# Altium schematic sheet PIC.SchDoc
size A
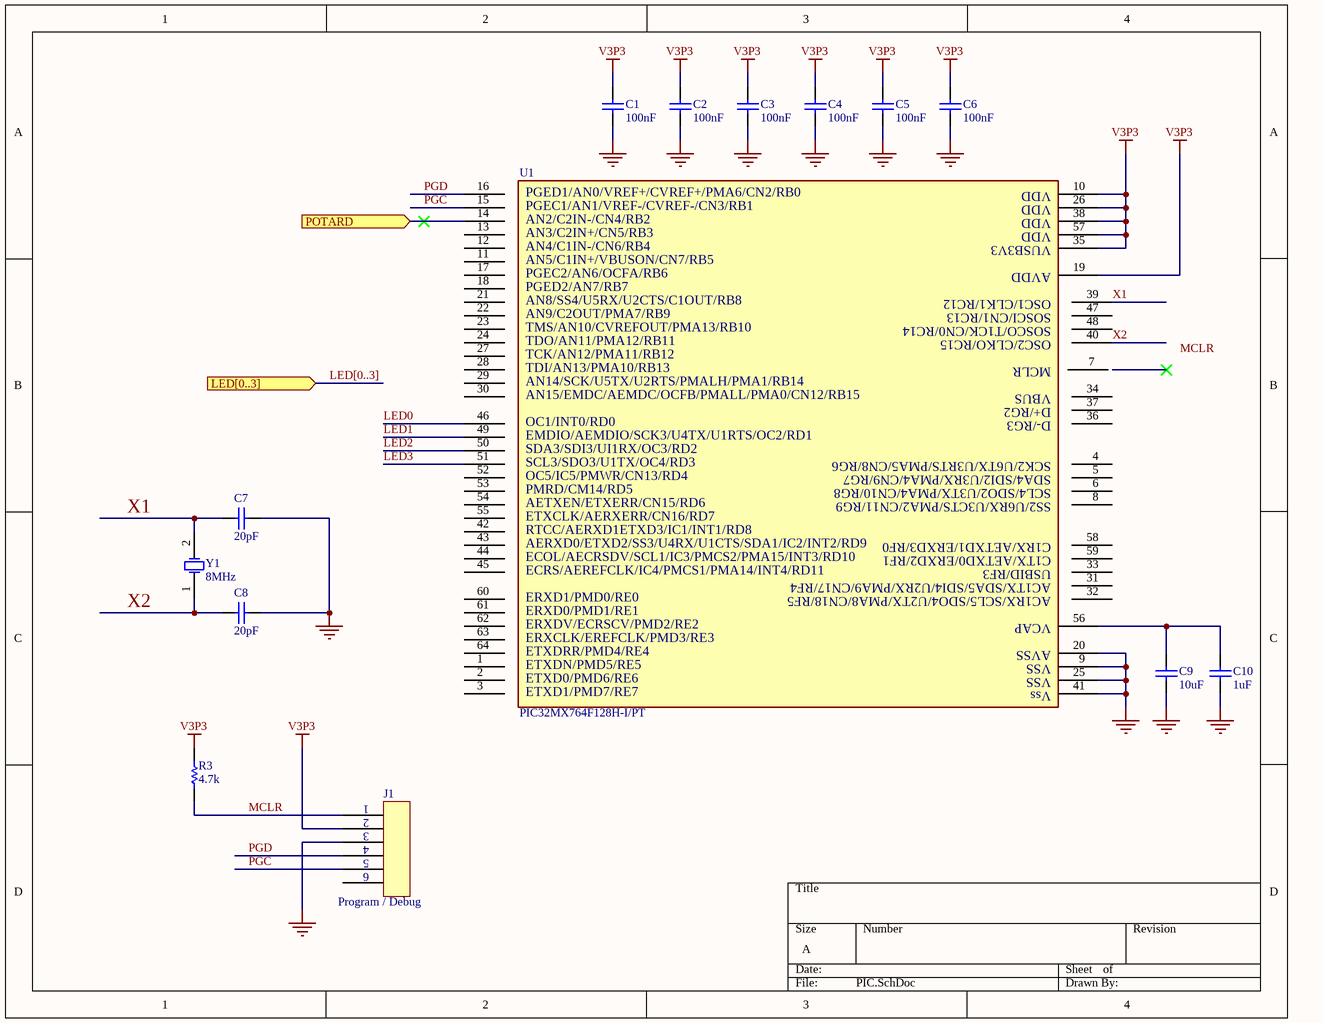
[diagram p0: PIC.SchDoc]

## Parts
C1  100nF  [CAPC1608N]
C2  100nF  [CAPC1608N]
C3  100nF  [CAPC1608N]
C4  100nF  [CAPC1608N]
C5  100nF  [CAPC1608N]
C6  100nF  [CAPC1608N]
C7  20pF  [CAPC1608N]
C8  20pF  [CAPC1608N]
C9  10uF  [CAPC2012N]
C10  1uF  [CAPC1608N]
J1  Program / Debug  [RJ12_90]
R3  4.7k  [RESC1608N]
U1  PIC32MX764F128H-I/PT  [PIC]
Y1  8MHz  [HC49/4H SMX CRYSTAL]

## Ports
LED[0..3] (in), POTARD

## Nets
GND: C7.2 C8.2
NetC1_1: C1.1 C2.1 C3.1 C4.1 C5.1 C6.1 C9.1 C10.1
V3P3: C1.2 C2.2 C3.2 C4.2 C5.2 C6.2 R3.2
MCLR: R3.1
X1: C7.1 Y1.2(OSC2)
X2: C8.1 Y1.1(OSC1)
NetC9_2: C9.2 C10.2

Not connected (* = marked no-connect by the designer): U1 1 2 3 4 5 6 7 8 9 10 11 12 13 14 15 16 17 18 19 20 21 22 23 24 25 26 27 28 29 30 31 32 33 34 35 36 37 38 39 40 41 42 43 44 45 46 47 48 49 50 51 52 53 54 55 56 57 58 59 60 61 62 63 64

## Buses and harness runs
bus LED[0..3] = port LED[0..3]

## Notes on the sheet
- Labels drawn without touching a wire or pin: MCLR
- (in symbol Pic - 32MX) VDD; PGED1/AN0/VREF+/CVREF+/PMA6/CN2/RB0; PGEC1/AN1/VREF-/CVREF-/CN3/RB1; AN2/C2IN-/CN4/RB2; AN3/C2IN+/CN5/RB3; VUSB3V3; AN4/C1IN-/CN6/RB4; AN5/C1IN+/VBUSON/CN7/RB5; AVDD; PGEC2/AN6/OCFA/RB6; PGED2/AN7/RB7; OSC1/CLK1/RC12; AN8/SS4/U5RX/U2CTS/C1OUT/RB8; SOSCI/CN1/RC13; AN9/C2OUT/PMA7/RB9; SOSCO/T1CK/CN0/RC14; TMS/AN10/CVREFOUT/PMA13/RB10; OSC2/CLKO/RC15; TDO/AN11/PMA12/RB11; TCK/AN12/PMA11/RB12; MCLR; TDI/AN13/PMA10/RB13; AN14/SCK/U5TX/U2RTS/PMALH/PMA1/RB14; VBUS; AN15/EMDC/AEMDC/OCFB/PMALL/PMA0/CN12/RB15; D+/RG2; D-/RG3; OC1/INT0/RD0; EMDIO/AEMDIO/SCK3/U4TX/U1RTS/OC2/RD1; SDA3/SDI3/UI1RX/OC3/RD2; SCK2/U6TX/U3RTS/PMA5/CN8/RG6; SCL3/SDO3/U1TX/OC4/RD3; SDA4/SDI2/U3RX/PMA4/CN9/RG7; OC5/IC5/PMWR/CN13/RD4; SCL4/SDO2/U3TX/PMA4/CN10/RG8; PMRD/CM14/RD5; SS2/U6RX/U3CTS/PMA2/CN11/RG9; AETXEN/ETXERR/CN15/RD6; ETXCLK/AERXERR/CN16/RD7; RTCC/AERXD1ETXD3/IC1/INT1/RD8; C1RX/AETXD1/ERXD3/RF0; AERXD0/ETXD2/SS3/U4RX/U1CTS/SDA1/IC2/INT2/RD9; C1TX/AETXD0/ERXD2/RF1; ECOL/AECRSDV/SCL1/IC3/PMCS2/PMA15/INT3/RD10; USBID/RF3; ECRS/AEREFCLK/IC4/PMCS1/PMA14/INT4/RD11; AC1TX/SDA5/SDI4/U2RX/PMA9/CN17/RF4; AC1RX/SCL5/SDO4/U2TX/PMA8/CN18/RF5; ERXD1/PMD0/RE0; ERXD0/PMD1/RE1; VCAP; ERXDV/ECRSCV/PMD2/RE2; ERXCLK/EREFCLK/PMD3/RE3; AVSS; ETXDRR/PMD4/RE4; VSS; ETXDN/PMD5/RE5; ETXD0/PMD6/RE6; Vss; ETXD1/PMD7/RE7
- (in symbol Program / Debug) 1; 2; 3; 4; 5; 6

## Library data of the parts
C1-C10 = Cap: Capacitor; Published: 8-Jun-2000; LatestRevisionDate: 17-Jul-2002; LatestRevisionNote: Re-released for DXP Platform.; PackageReference: RAD-0.3; Publisher: Altium Limited; PackageDescription: Radial Cap, Thru-Hole; 2 Leads; 0.3 in Pin Spacing
R3 = Res1: Resistor; Published: 8-Jun-2000; LatestRevisionDate: 17-Jul-2002; LatestRevisionNote: Re-released for DXP Platform.; PackageReference: AXIAL-0.3; Publisher: Altium Limited; PackageDescription: Axial Device, Thru-Hole; 2 Leads; 0.3 in Pin Spacing
U1 = Pic - 32MX: FABRICANT: MicroChip; FOURNISSEUR: <none>; REF. FABRICANT: PIC32MX764F128H-I/PT; REF. FOURNISSEUR: <none>
Y1 = XTAL: Crystal Oscillator; Published: 8-Jun-2000; LatestRevisionDate: 17-Jul-2002; LatestRevisionNote: Re-released for DXP Platform.; PackageReference: R38; Publisher: Altium Limited; PackageDescription: Crystal, Thru-Hole; 2 Leads; Body 3.1 x 8.2 mm (Dia.xH)